# EAGLE design Breakout Boosterpack (EAGLE 7.2.0)
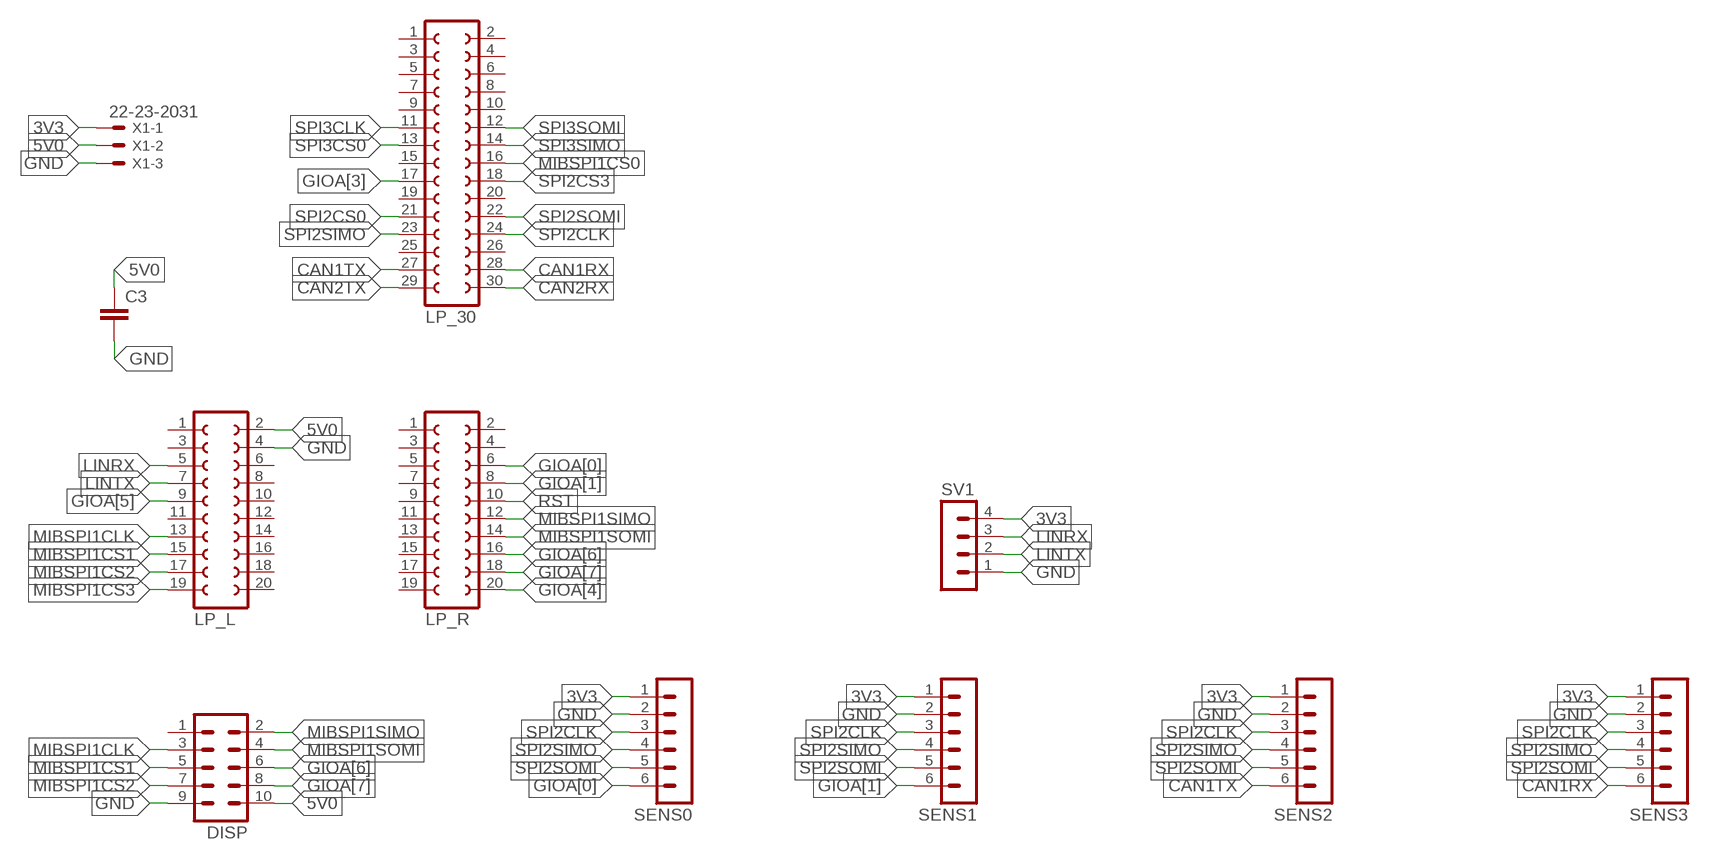
[diagram p0: schematic, sheet 1]

## Parts
C3  C2.5/5  [C2.5-5]
DISP  MA05-2  [MA05-2]
LP_30  FE15-2  [FE15-2]
LP_L  FE10-2  [FE10-2]
LP_R  FE10-2  [FE10-2]
SENS0  MA06-1  [MA06-1]
SENS1  MA06-1  [MA06-1]
SENS2  MA06-1  [MA06-1]
SENS3  MA06-1  [MA06-1]
SV1  MA04-1  [MA04-1]
X1  22-23-2031  [22-23-2031]

## Nets
3V3: SENS0.1 SENS1.1 SENS2.1 SENS3.1 SV1.4 X1.1
5V0: C3.1 DISP.10 LP_L.2 X1.2
CAN1RX: LP_30.28 SENS3.6
CAN1TX: LP_30.27 SENS2.6
CAN2RX: LP_30.30
CAN2TX: LP_30.29
GIOA[0]: LP_R.6 SENS0.6
GIOA[1]: LP_R.8 SENS1.6
GIOA[3]: LP_30.17
GIOA[4]: LP_R.20
GIOA[5]: LP_L.9
GIOA[6]: DISP.6 LP_R.16
GIOA[7]: DISP.8 LP_R.18
GND: C3.2 DISP.9 LP_L.4 SENS0.2 SENS1.2 SENS2.2 SENS3.2 SV1.1 X1.3
LINRX: LP_L.5 SV1.3
LINTX: LP_L.7 SV1.2
MIBSPI1CLK: DISP.3 LP_L.13
MIBSPI1CS0: LP_30.16
MIBSPI1CS1: DISP.5 LP_L.15
MIBSPI1CS2: DISP.7 LP_L.17
MIBSPI1CS3: LP_L.19
MIBSPI1SIMO: DISP.2 LP_R.12
MIBSPI1SOMI: DISP.4 LP_R.14
RST: LP_R.10
SPI2CLK: LP_30.24 SENS0.3 SENS1.3 SENS2.3 SENS3.3
SPI2CS0: LP_30.21
SPI2CS3: LP_30.18
SPI2SIMO: LP_30.23 SENS0.4 SENS1.4 SENS2.4 SENS3.4
SPI2SOMI: LP_30.22 SENS0.5 SENS1.5 SENS2.5 SENS3.5
SPI3CLK: LP_30.11
SPI3CS0: LP_30.13
SPI3SIMO: LP_30.14
SPI3SOMI: LP_30.12
Unconnected: DISP.1 LP_30.1 LP_30.2 LP_30.3 LP_30.4 LP_30.5 LP_30.6 LP_30.7 LP_30.8 LP_30.9 LP_30.10 LP_30.15 LP_30.19 LP_30.20 LP_30.25 LP_30.26 LP_L.1 LP_L.3 LP_L.6 LP_L.8 LP_L.10 LP_L.11 LP_L.12 LP_L.14 LP_L.16 LP_L.18 LP_L.20 LP_R.1 LP_R.2 LP_R.3 LP_R.4 LP_R.5 LP_R.7 LP_R.9 LP_R.11 LP_R.13 LP_R.15 LP_R.17 LP_R.19

## Library data of the parts
C3 = capacitor-wima:C: CAPACITOR naming: grid - package width
DISP = con-lstb:MA05-2: PIN HEADER; OC_FARNELL: unknown; OC_NEWARK: unknown
LP_30 = con-lsta:FE15-2: FEMALE HEADER; OC_FARNELL: unknown; OC_NEWARK: unknown
LP_L LP_R = con-lsta:FE10-2: FEMALE HEADER; OC_FARNELL: unknown; OC_NEWARK: unknown
SENS0 SENS1-SENS3 = con-lstb:MA06-1: PIN HEADER; OC_FARNELL: unknown; OC_NEWARK: unknown
SV1 = con-lstb:MA04-1: PIN HEADER; OC_FARNELL: unknown; OC_NEWARK: unknown
X1 = con-molex:22-23-2031: .100" (2.54mm) Center Header - 3 Pin; MF: MOLEX; MPN: 22-23-2031; OC_FARNELL: 1462950; OC_NEWARK: 30C0862

## Board
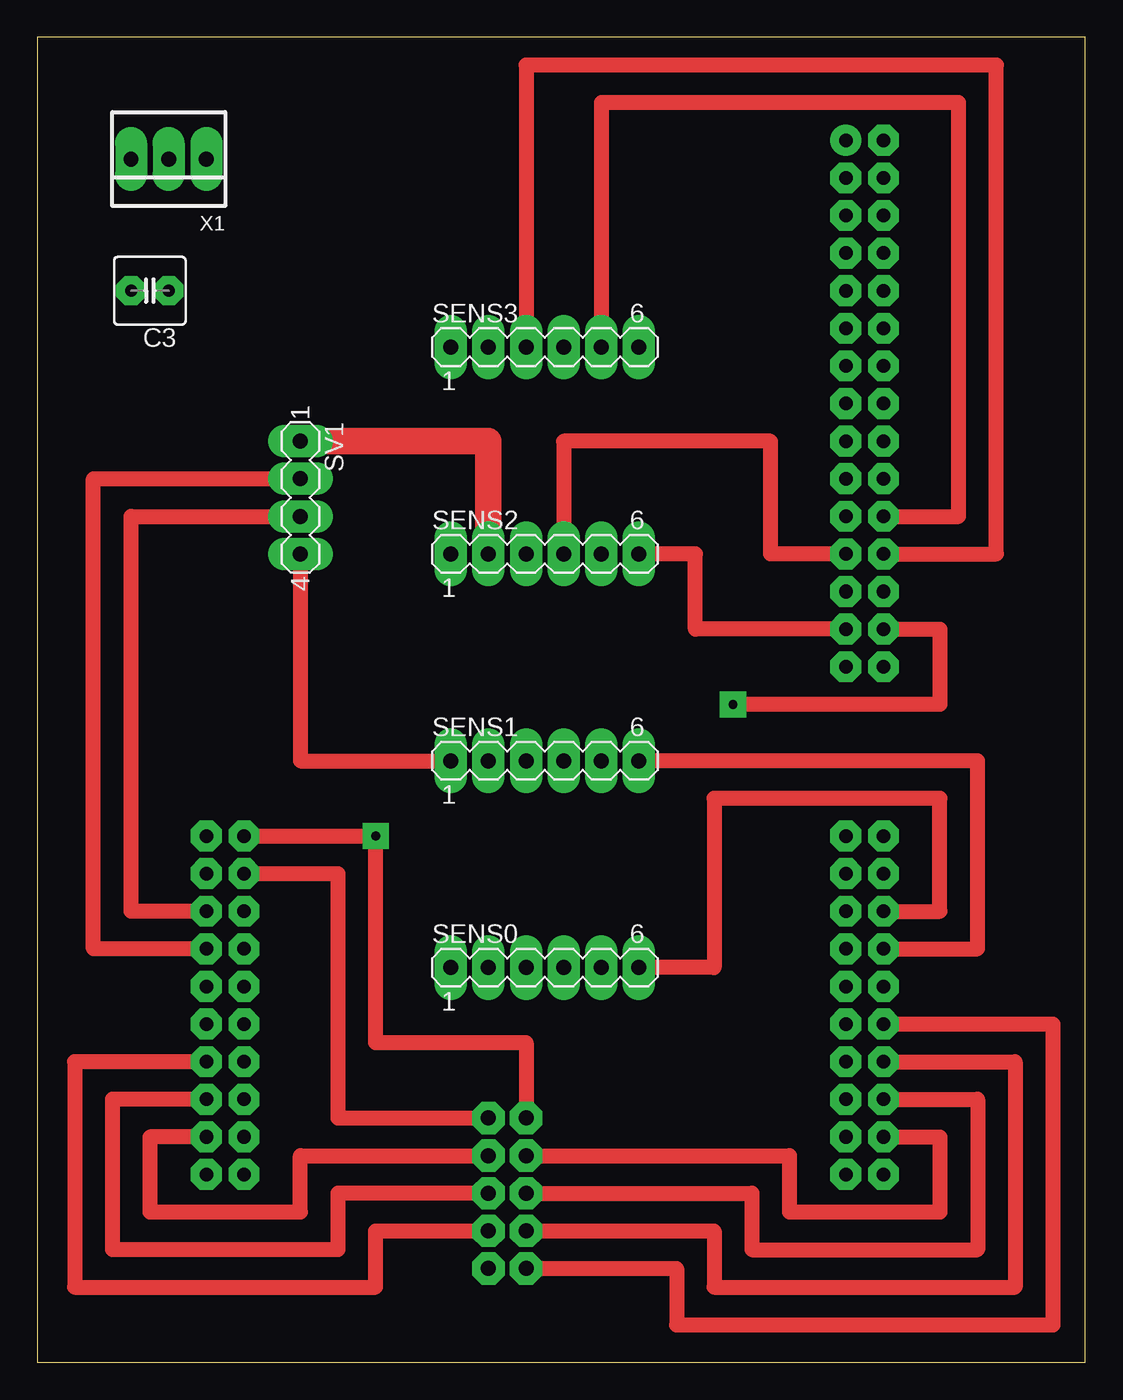
[diagram p1: board, top side]
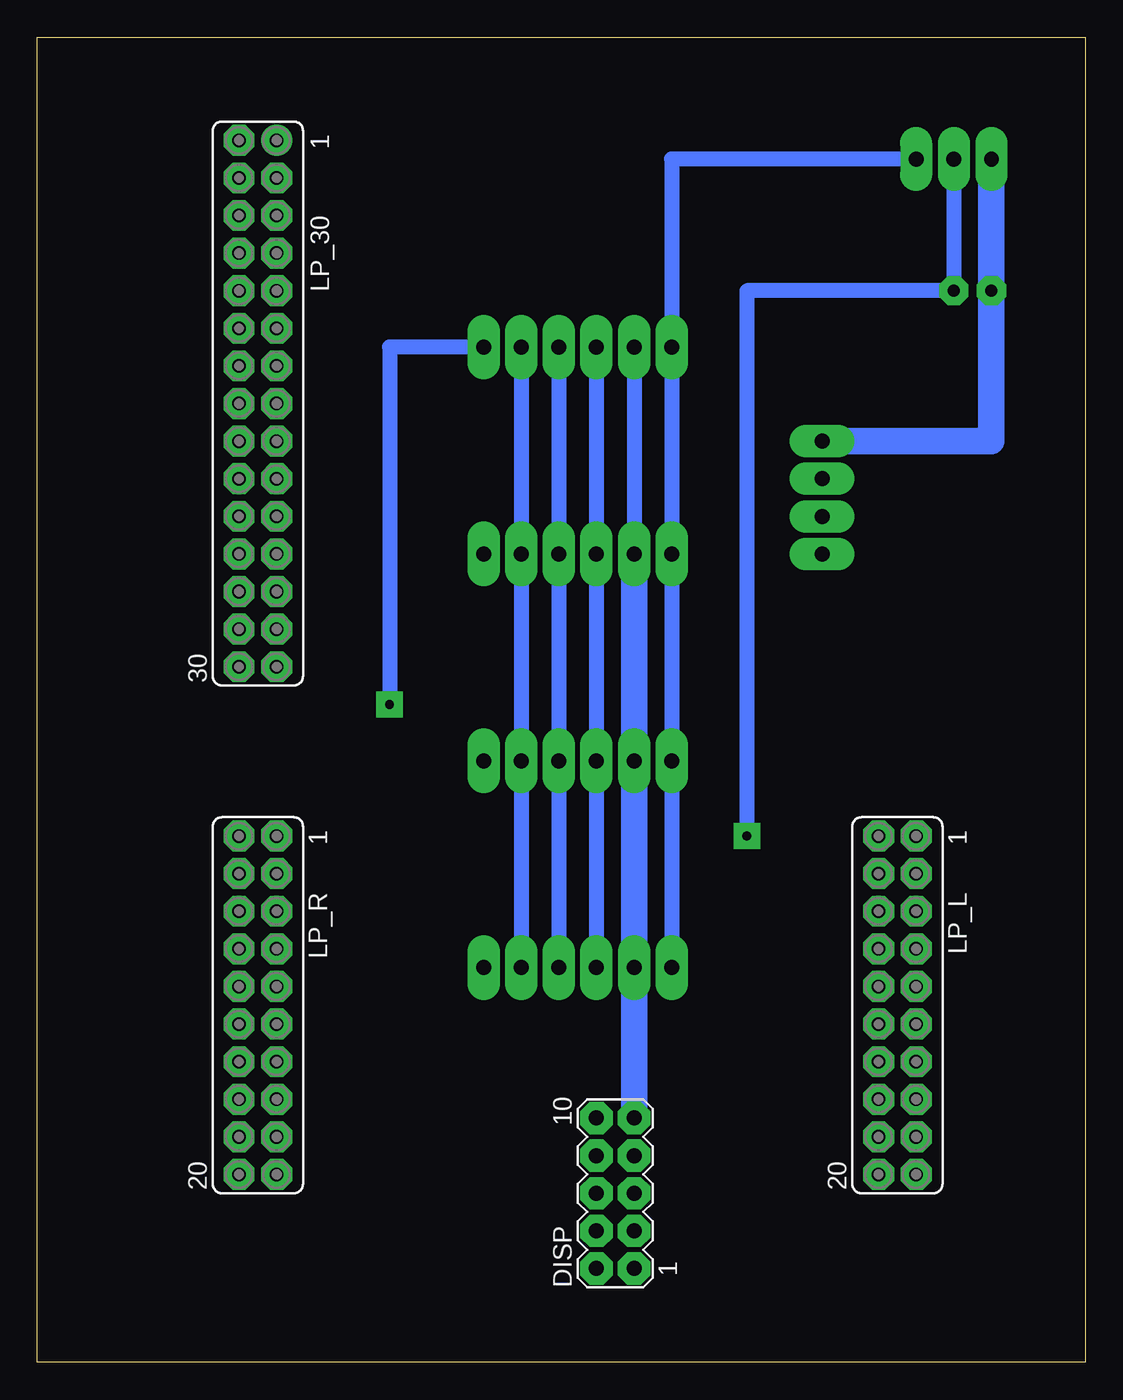
[diagram p2: board, bottom side, seen from below]

Size 70.79 x 89.53 mm. Coordinates in mm from the lower left corner, seen from the top.
Outline: 0,0 70.79,0 70.79,89.53 0,89.53 0,0
Copper layers (1*16): Top 0.035mm / dielectric 1.5mm / Bottom 0.035mm
Design rules "default *": minimum track width 40mil, minimum drill 24mil, track to track 40mil, track to pad 20mil, pad to pad 10mil, via to via 20mil, smd to smd 0mil, copper to edge 40mil, drill to drill 40mil, minimum pad ring 23mil, minimum via ring 23mil, stop-mask expansion 4mil, vias tented up to drill 0mil, thermal gap 10mil

### Footprints (pad centres in the part's own frame; a part is rotated, then mirrored left to right if it is on the bottom)
C2.5-5 = drill 0.813 pad 1.6 octagon: 1 -1.27,0; 2 1.27,0
MA05-2 = drill 1.016 octagon: 1 -5.08,-1.27; 2 -5.08,1.27; 3 -2.54,-1.27; 4 -2.54,1.27; 5 0,-1.27; 6 0,1.27; 7 2.54,-1.27; 8 2.54,1.27; 9 5.08,-1.27; 10 5.08,1.27
FE15-2 = drill 0.914: 1 -17.78,1.27 | drill 0.914 octagon: 2 -17.78,-1.27; 3 -15.24,1.27; 4 -15.24,-1.27; 5 -12.7,1.27; 6 -12.7,-1.27; 7 -10.16,1.27; 8 -10.16,-1.27; 9 -7.62,1.27; 10 -7.62,-1.27; 11 -5.08,1.27; 12 -5.08,-1.27; 13 -2.54,1.27; 14 -2.54,-1.27; 15 0,1.27; 16 0,-1.27; 17 2.54,1.27; 18 2.54,-1.27; 19 5.08,1.27; 20 5.08,-1.27; 21 7.62,1.27; 22 7.62,-1.27; 23 10.16,1.27; 24 10.16,-1.27; 25 12.7,1.27; 26 12.7,-1.27; 27 15.24,1.27; 28 15.24,-1.27; 29 17.78,1.27; 30 17.78,-1.27
FE10-2 = drill 0.914 octagon: 1 -11.43,1.27; 2 -11.43,-1.27; 3 -8.89,1.27; 4 -8.89,-1.27; 5 -6.35,1.27; 6 -6.35,-1.27; 7 -3.81,1.27; 8 -3.81,-1.27; 9 -1.27,1.27; 10 -1.27,-1.27; 11 1.27,1.27; 12 1.27,-1.27; 13 3.81,1.27; 14 3.81,-1.27; 15 6.35,1.27; 16 6.35,-1.27; 17 8.89,1.27; 18 8.89,-1.27; 19 11.43,1.27; 20 11.43,-1.27
MA06-1 = drill 1.016 long: 1 -6.35,0; 2 -3.81,0; 3 -1.27,0; 4 1.27,0; 5 3.81,0; 6 6.35,0
MA04-1 = drill 1.016 long: 1 -3.81,0; 2 -1.27,0; 3 1.27,0; 4 3.81,0
22-23-2031 = drill 1 long: 1 -2.54,0; 2 0,0; 3 2.54,0

### Placement (x,y rotation side)
C3  7.62,72.39 180 top
DISP  31.75,11.43 90 bottom
LP_30  55.88,64.77 270 bottom
LP_L  12.7,24.13 270 bottom
LP_R  55.88,24.13 270 bottom
SENS0  34.29,26.67 0 top
SENS1  34.29,40.64 0 top
SENS2  34.29,54.61 0 top
SENS3  34.29,68.58 0 top
SV1  17.78,58.42 270 top
X1  8.89,81.28 180 top

### Tracks (layer width: path | path; a pad name or v marks a point on that pad's centre or on a via)
3V3
  Top 1.016: SV1.4 17.78,40.64 SENS1.1
  Bottom 1.016: X1.1 27.94,81.28 SENS3.1 SENS2.1 SENS1.1 SENS0.1
5V0  (via drill 0.6)
  Top 1.016: LP_L.2 v22.86,35.56 22.86,21.59 33.02,21.59 DISP.10
  Bottom 1.016: X1.2 C3.1 22.86,72.39 v22.86,35.56
CAN1RX  (via drill 0.6)
  Top 1.016: LP_30.28 60.96,49.53 60.96,44.45 v46.99,44.45
  Bottom 1.016: SENS3.6 46.99,68.58 v46.99,44.45
CAN1TX
  Top 1.016: LP_30.27 44.45,49.53 44.45,54.61 SENS2.6
GIOA[0]
  Top 1.016: LP_R.6 60.96,30.48 60.96,38.1 45.72,38.1 45.72,26.67 SENS0.6
GIOA[1]
  Top 1.016: LP_R.8 63.5,27.94 63.5,40.64 SENS1.6
GIOA[6]
  Top 1.016: LP_R.16 63.5,17.78 63.5,7.62 48.26,7.62 48.26,11.43 DISP.6
GIOA[7]
  Top 1.016: LP_R.18 60.96,15.24 60.96,10.16 50.8,10.16 50.8,13.97 DISP.8
GND
  Top 1.016: LP_L.4 20.32,33.02 20.32,16.51 DISP.9
  Top 1.778: SV1.1 30.48,62.23 SENS2.2
  Bottom 1.016: SENS3.2 SENS2.2
  Bottom 1.778: X1.3 C3.2 6.35,62.23 SV1.1 | SENS2.2 SENS1.2 SENS0.2 DISP.9
LINRX
  Top 1.016: LP_L.5 6.35,30.48 6.35,57.15 SV1.3
LINTX
  Top 1.016: LP_L.7 3.81,27.94 3.81,59.69 SV1.2
MIBSPI1CLK
  Top 1.016: LP_L.13 2.54,20.32 2.54,5.08 22.86,5.08 22.86,8.89 DISP.3
MIBSPI1CS1
  Top 1.016: LP_L.15 5.08,17.78 5.08,7.62 20.32,7.62 20.32,11.43 DISP.5
MIBSPI1CS2
  Top 1.016: LP_L.17 7.62,15.24 7.62,10.16 17.78,10.16 17.78,13.97 DISP.7
MIBSPI1SIMO
  Top 1.016: LP_R.12 68.58,22.86 68.58,2.54 43.18,2.54 43.18,6.35 DISP.2
MIBSPI1SOMI
  Top 1.016: LP_R.14 66.04,20.32 66.04,5.08 45.72,5.08 45.72,8.89 DISP.4
SPI2CLK
  Top 1.016: LP_30.24 64.77,54.61 64.77,87.63 33.02,87.63 SENS3.3
  Bottom 1.016: SENS3.3 SENS2.3 SENS1.3 SENS0.3
SPI2SIMO
  Top 1.016: LP_30.23 49.53,54.61 49.53,62.23 35.56,62.23 SENS2.4
  Bottom 1.016: SENS3.4 SENS2.4 SENS1.4 SENS0.4
SPI2SOMI
  Top 1.016: LP_30.22 62.23,57.15 62.23,85.09 38.1,85.09 SENS3.5
  Bottom 1.016: SENS3.5 SENS2.5 SENS1.5 SENS0.5